# Altium schematic sheet PWR_TPS54623_3v5_3A.SchDoc
size A3; SheetNumber: 22; SheetTotal: 22
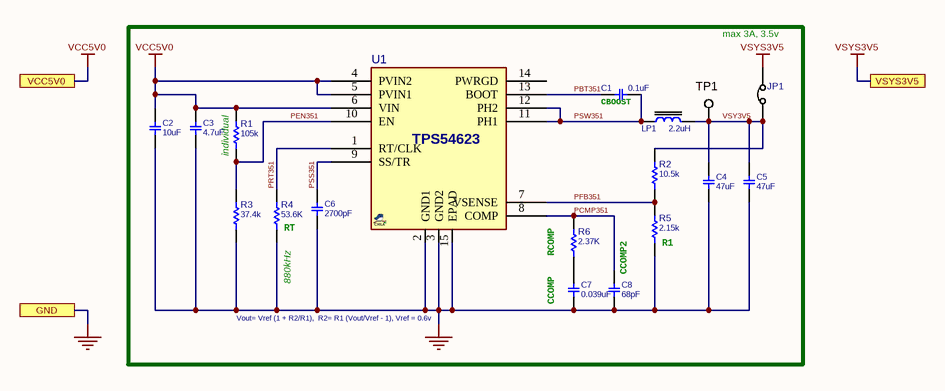
[diagram p0: PWR_TPS54623_3v5_3A.SchDoc]

## Parts
C1  0.1uF  [C0402]
C2  10uF  [C0402]
C3  4.7uF  [C0402]
C4  47uF  [C0805]
C5  47uF  [C0805]
C6  2700pF  [C0402]
C7  0.039uF  [C0402]
C8  68pF  [C0402]
JP1  R0Ohm  [JP_100X60]  (value not drawn)
LP1  2.2uH  [L_5]
R1  105k  [R0402]
R2  10.5k  [R0402]
R3  37.4k  [R0402]
R4  53.6K  [R0402]
R5  2.15k  [R0402]
R6  2.37K  [R0402]
TP1  TESTPOINT_SMD  [TPSMD_S1]  (value not drawn)  (no BOM)
U1  TPS54623  [QFN50_14T_3535]  (value not drawn)

## Ports
GND, VCC5V0, VSYS3V5

## Nets
GND: C2.1 C3.1 C4.2 C5.2 C6.2 C7.2 C8.2 R3.2 R4.2 R5.2 U1.2(GND1) U1.3(GND2) U1.15(EPAD) ; port GND
VCC5V0: C2.2 C3.2 R1.1 U1.4(PVIN2) U1.5(PVIN1) U1.6(VIN) ; port VCC5V0
VSYS3V5: JP1.2 ; port VSYS3V5
PBT351: C1.1 U1.13(BOOT)
PCMP351: C8.1 R6.1 U1.8(COMP)
PEN351: R1.2 R3.1 U1.10(EN)
PFB351: R2.2 R5.1 U1.7(VSENSE)
PRT351: R4.1 U1.1(RT/CLK)
PSS351: C6.1 U1.9(SS/TR)
PSW351: C1.2 LP1.1 U1.11(PH1) U1.12(PH2)
VSY3V5: C4.1 C5.1 JP1.1 LP1.2 R2.1 TP1.1
NetC7_1: C7.1 R6.2

Not connected (* = marked no-connect by the designer): U1 14(PWRGD)

## Notes on the sheet
- (near JP1) max 3A, 3.5v
- (near C1) CBOOST
- (near R1) individual
- (near R4) RT
- (near R6) RCOMP
- (near R5) R1
- Vout= Vref (1 + R2/R1),  R2= R1 (Vout/Vref - 1), Vref = 0.6v
- (near R4) 880kHz
- (near C7) CCOMP
- (near C8) CCOMP2

## Library data of the parts
C1 = CAP_SMD_MLCC_100n50V: CAP, MLCC, 100nF, 50V, X7R, 10%, 0402C; PARAM: X5R, 10%; MANF: Murata; PARAM2: 25v; MANF_P#: GRM155R61E104; DESC: CAP, MLCC, 100nF, 50V, X7R, 10%, 0402C; ASSEMBLY: ASSEMBLY; PRICE: 10,000:$0.006; VALUE: 0.1uF
C2 = CAP_SMD_MLCC: CAP, MLCC; PARAM: X5R, 20%; MANF_P#: CL05A106MP5NUNC; MANF: Samsung; PARAM2: 10v; PRICE: 10,000: $0.034; ASSEMBLY: ASSEMBLY; VALUE: 10uF
C3 = CAP_SMD_MLCC: CAP, MLCC; PARAM: X5R, 20%; MANF_P#: CL05A475MP5NRNC; MANF: Samsung; PARAM2: 10v; PRICE: 10,000:	$0.013; ASSEMBLY: ASSEMBLY; VALUE: 4.7uF
C4 C5 = CAP_SMD_MLCC_47u25V: CAP, MLCC, X5R 47uF 25V 20% 1206; PARAM: 6.3v; MANF: Samsung; PARAM2: X5R, 20%; MANF_P#: CL21A476MQYNNNE; DESC: CAP, MLCC, X5R 47uF 25V 20% 1206; PRICE: 500= 265$; VALUE: 47uF
C6-C8 = CAP_SMD_MLCC_100n50V: CAP, MLCC, 0402C; PARAM: 50V; MANF: -; DESC: -; PARAM2: -; ASSEMBLY: ASSEMBLY; PRICE: 100= 1.3$; MANF_P#: -
  C6: VALUE: 2700pF
  C7: VALUE: 0.039uF
  C8: VALUE: 68pF
JP1 = JUMPER_HDR_2P: JUMPER, HEADER 2PIN; MANF: -; MANF_P#: -; VALUE: R0Ohm
LP1 = IND_SMD_2.2uH_4A: INDUCTOR, 3.3uH, 8A (Irms), 10mOhm; PARAM: 5.5A Isat; MANF: Vishay; PARAM2: 22mOhm; MANF_P#: IHLP2020CZER2R2M11; PRICE: 1.3$; DESC: INDUCTOR, 3.3uH, 8A (Irms), 10mOhm; ASSEMBLY: ASSEMBLY; VALUE: 2.2uH
R1-R6 = RES_SMD: RESISTOR, SMD, 20K, 0402; PARAM: 0.063W; DIST#: MOUSER; PARAM2: 1%; MANF: -; ASSEMBLY: ASSEMBLY; PRICE: 100= 0.5$; DESC: RESISTOR, SMD, 20K, 0402; MANF_P#: -
  R1: VALUE: 105k
  R2: VALUE: 10.5k
  R3: VALUE: 37.4k
  R4: VALUE: 53.6K
  R5: VALUE: 2.15k
  R6: VALUE: 2.37K
TP1 = TESTPOINT_SMD: TEST POINT; MANF: MANF; MANF_P#: MANF_P#; VALUE: VALUE
U1 = VREG_TPS54623_VQFN14: REG, Switching, Buck, 6A, ADJ, 1.6MHz, 4.5~17Vin, VQFN-14; MANF: TI; MANF_P#: TPS54623RHL; PARAM: 6A, 1.6MHz, 26/19mΩ, -40~125oC; PARAM2: 4.5~17Vin, ADJ; ASSEMBLY: ASSEMBLY; PRICE: 1$; VALUE: TPS54623